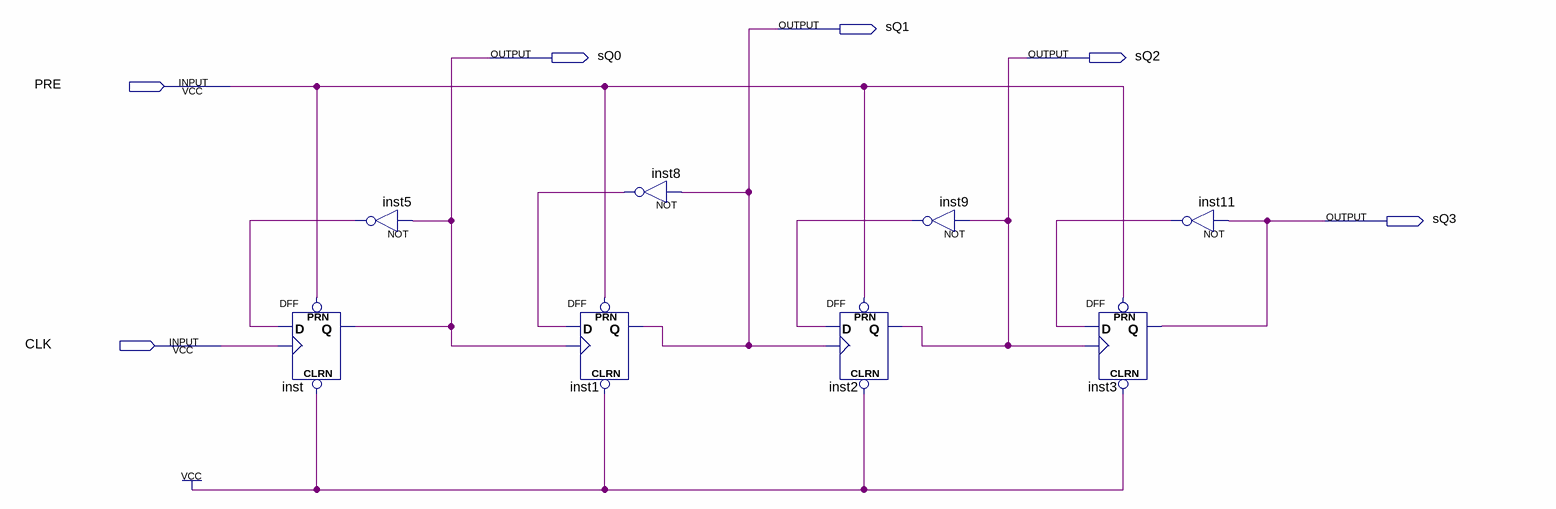
[diagram p0: schematic sheet]
// Quartus schematic skewedClock.bdf as structural Verilog: 8 symbols, 6 pins
module skewedClock (
  input  PRE,
  input  CLK,
  output sQ1,
  output sQ0,
  output sQ2,
  output sQ3
);

  wire inst5_out, inst8_out, inst9_out, inst11_out;

  DFF inst (.CLRN(1'b1), .CLK(CLK), .D(inst5_out), .PRN(PRE), .Q(sQ0));
  not inst5 (inst5_out, sQ0);
  not inst8 (inst8_out, sQ1);
  DFF inst1 (.CLRN(1'b1), .CLK(sQ0), .D(inst8_out), .PRN(PRE), .Q(sQ1));
  DFF inst2 (.CLRN(1'b1), .CLK(sQ1), .D(inst9_out), .PRN(PRE), .Q(sQ2));
  not inst9 (inst9_out, sQ2);
  DFF inst3 (.CLRN(1'b1), .CLK(sQ2), .D(inst11_out), .PRN(PRE), .Q(sQ3));
  not inst11 (inst11_out, sQ3);
endmodule
